# EasyEDA Pro project small_tv.eprj

# Schematic Schematic1
Create Date: 2023-07-25; Page Name: P1; Project Name: small_tv; Schematic Name: Schematic1; Update Date: 2023-07-28; Company: 嘉立创EDA; Page Size: A4; Version: V1.0
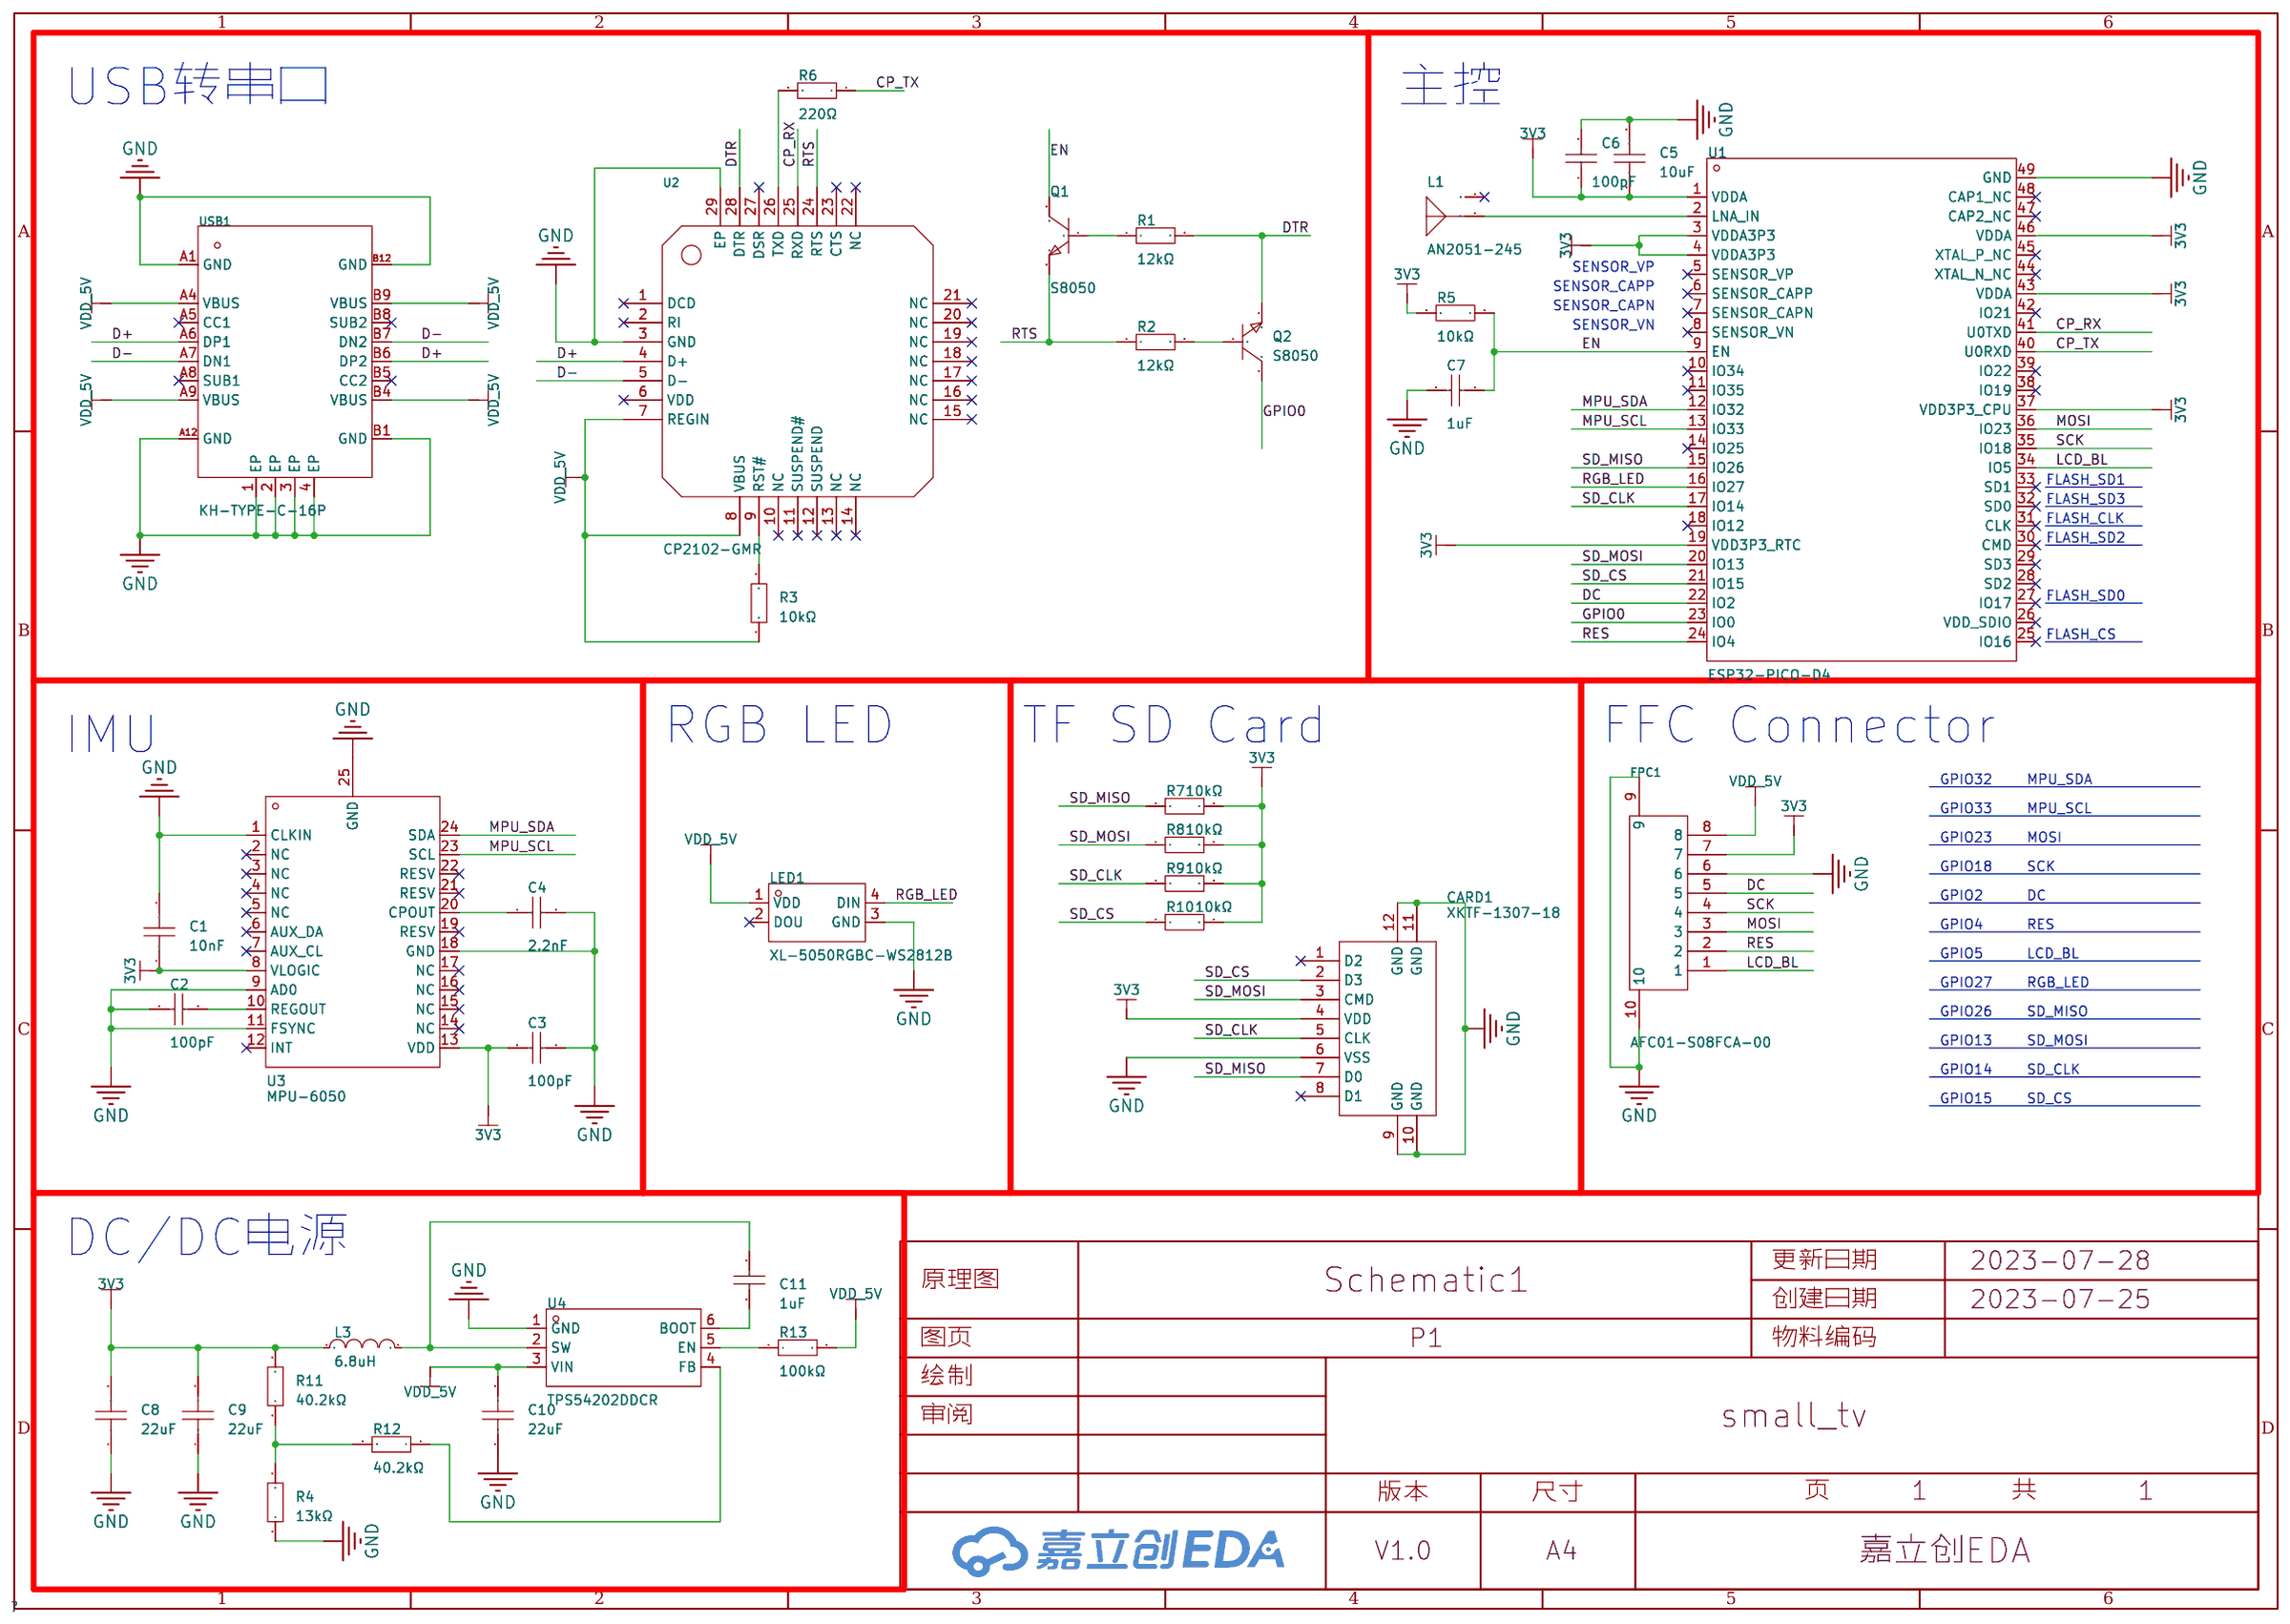
[diagram p0: schematic sheet]

## Parts
C1  10nF  [C0402]
C2  100pF  [C0402]
C3  100pF  [C0402]
C4  2.2nF  [C0402]
C5  10uF  [C0402]
C6  100pF  [C0402]
C7  1uF  [C0402]
C8  22uF  [C0402]
C9  22uF  [C0402]
C10  22uF  [C0402]
C11  1uF  [C0402]
CARD1  XKTF-1307-18  [TF-SMD_XKTF-1307-18]
FPC1  AFC01-S08FCA-00  [FPC-SMD_P0.50-8P_FGS-XJ-H2.0]
L1  AN2051-245  [ANT2051]
L3  6.8uH  [IND-SMD_L4.4-W4.2]
LED1  XL-5050RGBC-WS2812B  [LED-SMD_4P-L5.0-W5.0-BL_XL-5050RGBC]
Q1  S8050  [SOT-23-3_L2.9-W1.6-P1.90-LS2.8-BR]
Q2  S8050  [SOT-23-3_L2.9-W1.6-P1.90-LS2.8-BR]
R1  12kΩ  [R0402]
R2  12kΩ  [R0402]
R3  10kΩ  [R0402]
R4  13kΩ  [C0402]
R5  10kΩ  [R0402]
R6  220Ω  [R0402]
R7  10kΩ  [R0402]
R8  10kΩ  [R0402]
R9  10kΩ  [R0402]
R10  10kΩ  [R0402]
R11  40.2kΩ  [C0402]
R12  40.2kΩ  [C0402]
R13  100kΩ  [C0402]
U1  ESP32-PICO-D4  [LGA-48_L7.0-W7.0-P0.50-BL-EP5.4]
U2  CP2102-GMR  [WQFN-28_L5.0-W5.0-P0.50-BL-EP3.2]
U3  MPU-6050  [QFN-24_L4.0-W4.0-P0.50-BL-EP2.7]
U4  TPS54202DDCR  [SOT-23-6_L2.9-W1.6-P0.95-LS2.8-BL]
USB1  KH-TYPE-C-16P  [USB-C-SMD_KH-TYPE-C-16P]

## Library data of the parts
C1 C5 = CL10A106KP8NNNC: 容值:10uF;精度:±10%;额定电压:10V;材质(温度系数):X5R;; LCSC Part Name: 10uF ±10% 10V; Supplier Part: C19702; Manufacturer: SAMSUNG(三星); Supplier Footprint: 0603; JLCPCB Part Class: 基础库; Datasheet: https://atta.szlcsc.com/upload/public/pdf/source/20160103/1457707703378.pdf; Supplier: LCSC; Tolerance: ±10%; Voltage Rated: 10V; Temperature Coefficient: X5R
C2 C3 C6 = CL10C101JB8NNNC: 容值:100pF;精度:±5%;额定电压:50V;材质(温度系数):C0G;; LCSC Part Name: 100pF ±5% 50V; Supplier Part: C14858; Manufacturer: SAMSUNG(三星); Supplier Footprint: 0603; JLCPCB Part Class: 基础库; Datasheet: https://atta.szlcsc.com/upload/public/pdf/source/20160103/1457707672333.pdf; Supplier: LCSC; Tolerance: ±5%; Voltage Rated: 50V; Temperature Coefficient: C0G
C4 = CC0603JRNPO9BN222: 容值:2.2nF;精度:±5%;额定电压:50V;材质(温度系数):NP0;; LCSC Part Name: 2.2nF ±5% 50V; Supplier Part: C107043; Manufacturer: YAGEO(国巨); Supplier Footprint: 0603; JLCPCB Part Class: 扩展库; Datasheet: https://atta.szlcsc.com/upload/public/pdf/source/20170420/1492670691515.pdf; Supplier: LCSC; Tolerance: ±5%; Voltage Rated: 50V; Temperature Coefficient: NP0
C7 C11 = CL10A105KB8NNNC: 容值:1uF;精度:±10%;额定电压:50V;材质(温度系数):X5R;; LCSC Part Name: 1uF ±10% 50V; Supplier Part: C15849; Manufacturer: SAMSUNG(三星); Supplier Footprint: 0603; JLCPCB Part Class: 基础库; Datasheet: https://atta.szlcsc.com/upload/public/pdf/source/20160103/1457707679084.pdf; Supplier: LCSC; Tolerance: ±10%; Voltage Rated: 50V; Temperature Coefficient: X5R
C8-C10 = CL10A226MP8NUNE: 容值:22uF;精度:±20%;额定电压:10V;材质(温度系数):X5R;; LCSC Part Name: 22uF ±20% 10V; Supplier Part: C86295; Manufacturer: SAMSUNG(三星); Supplier Footprint: 0603; JLCPCB Part Class: 扩展库; Datasheet: https://atta.szlcsc.com/upload/public/pdf/source/20170325/1490427882169.pdf; Supplier: LCSC; Tolerance: ±20%; Voltage Rated: 10V; Temperature Coefficient: X5R
CARD1 = XKTF-1307-18: 卡连接方式:翻盖式;卡类型:MicroSD卡(TF卡);连接器类型:卡座;本体最大高度:1.8mm;触头材质:铜合金;触头镀层:金;工作温度范围:-25℃~+80℃;焊接温度(最大值):260℃;; LCSC Part Name: 翻盖式 MicroSD卡(TF卡) 卡座; Supplier Part: C883270; Manufacturer: XKB Connectivity(中国星坤); Supplier Footprint: SMD; JLCPCB Part Class: 扩展库; Datasheet: https://atta.szlcsc.com/upload/public/pdf/source/20201016/C883270_E734F097901BAAAB6B007AA2692E6303.pdf; Supplier: LCSC; Card Connection Mode: 翻盖式; Card Type: MicroSD卡(TF卡); Connector Type: 卡座; Maximum Body Height: 1.8mm; Contact Material: 铜合金; Contact Plating: 金; Operating Temperature Range: -25℃~+80℃; Welding Temperature (Max): 260℃
FPC1 = AFC01-S08FCA-00: 间距:0.5mm;触点数量:8P;锁定特性:翻盖式;安装类型:卧贴;触点类型:下接;; LCSC Part Name: 0.5mm P数:8P 翻盖式 下接; Supplier Part: C262657; Manufacturer: JS(钜硕电子); Supplier Footprint: SMD,P=0.5mm; JLCPCB Part Class: 扩展库; Datasheet: https://atta.szlcsc.com/upload/public/pdf/source/20190816/C413942_2A72D1AC756EAE17EEDF756A339D4500.pdf; Supplier: LCSC; Pitch: 0.5mm; Number of Contacts: 8P; Locking Feature: 翻盖式; Mounting Type: 卧贴; Contact Type: 下接; Height Above Board: 2mm; FFC, FCB Thickness: 0.3mm
L1 = AN2051-245: 小体积，高增益，WIFI，蓝牙，zigBee 2.4G天线; Supplier Part: C99727; Manufacturer: rainsun(霖昱微); Supplier Footprint: 2x5.1mm; JLCPCB Part Class: 扩展库; Datasheet: https://atta.szlcsc.com/upload/public/pdf/source/20170329/1490752053541.pdf; Supplier: LCSC
L3 = FXL0420-6R8-M: 电感值:6.8uH;精度:±20%;额定电流:2.4A;饱和电流(Isat):2.5A;; LCSC Part Name: 6.8uH ±20% 2.5A; Supplier Part: C177241; Manufacturer: cjiang(长江微电); Supplier Footprint: SMD,4.2x4.4mm; JLCPCB Part Class: 扩展库; Datasheet: https://atta.szlcsc.com/upload/public/pdf/source/20190322/C177241_926E0DC8333CBC0DC90F3B0802D0087D.pdf; Supplier: LCSC; Tolerance: ±20%; Rated Current: 2.4A; Saturation Current (Isat): 2.5A; DC Resistance (DCR): 160mΩ
LED1 = XL-5050RGBC-WS2812B: 发光颜色:RGB三色;二极管配置:-;主波长:-;色温:-;功率:-;安装方式:正贴;; LCSC Part Name: RGB三色 正贴 幻彩; Supplier Part: C2843785; Manufacturer: XINGLIGHT(成兴光); Supplier Footprint: SMD5050; JLCPCB Part Class: 扩展库; Datasheet: https://atta.szlcsc.com/upload/public/pdf/source/20230111/86AAD2096485A2E5BCAB883FF8CBE6FD.pdf; Supplier: LCSC; Emitted Color: RGB三色; Lens Color: 无色透明; Peak Wavelength: 625nm；470nm；530nm; Viewing Angle: 120°; Mounting Sytle: 正贴; Operating Temperature: -30℃~+70℃
Q1 Q2 = S8050_C105433: 晶体管类型:NPN;集射极击穿电压(Vceo):25V;集电极电流(Ic):500mA;功率(Pd):300mW;直流电流增益(hFE@Ic,Vce):120@50mA,1V;; LCSC Part Name: NPN 25V 500mA L档 120-200; Supplier Part: C105433; Manufacturer: CJ(江苏长电/长晶); Supplier Footprint: SOT-23; JLCPCB Part Class: 扩展库; Datasheet: https://atta.szlcsc.com/upload/public/pdf/source/20170415/1492237762328.pdf; Supplier: LCSC; Transistor Type: NPN; Collector-Emitter Breakdown Voltage (Vceo): 25V; Collector Current (Ic): 500mA; Power Dissipation (Pd): 300mW; Collector Cut-Off Current (Icbo): 100nA; Collector-Emitter Saturation Voltage (VCE(sat)@Ic,Ib): 600mV@500mA,50mA; DC Current Gain (hFE@Ic,Vce): 120@50mA,1V; Transition Frequency (fT): 150MHz; Operating Temperature: +150℃@(Tj)
R1 R2 = 0603WAF1202T5E: 电阻类型:厚膜电阻;阻值:12kΩ;精度:±1%;功率:100mW;; LCSC Part Name: 12kΩ ±1% 100mW; Supplier Part: C22790; Manufacturer: UNI-ROYAL(厚声); Supplier Footprint: 0603; JLCPCB Part Class: 基础库; Datasheet: https://atta.szlcsc.com/upload/public/pdf/source/20200306/C422600_1E6D84923E4A46A82E41ADD87F860B5C.pdf; Supplier: LCSC; Type: 厚膜电阻; Tolerance: ±1%; Power(Watts): 100mW; Temperature Coefficient: ±100ppm/℃; Overload Voltage (Max): 75V; Operating Temperature Range: -55℃~+155℃
R3 R5 R7-R10 = 0603WAF1002T5E: 电阻类型:厚膜电阻;阻值:10kΩ;精度:±1%;功率:100mW;; LCSC Part Name: 厚膜电阻 10kΩ ±1% 100mW; Supplier Part: C25804; Manufacturer: UNI-ROYAL(厚声); Supplier Footprint: 0603; JLCPCB Part Class: 基础库; Datasheet: https://atta.szlcsc.com/upload/public/pdf/source/20200306/C422600_1E6D84923E4A46A82E41ADD87F860B5C.pdf; Supplier: LCSC; Type: 厚膜电阻; Tolerance: ±1%; Power(Watts): 100mW; Temperature Coefficient: ±100ppm/℃; Overload Voltage (Max): 75V; Operating Temperature Range: -55℃~+155℃
R4 = 0603WAF1302T5E: 电阻类型:厚膜电阻;阻值:13kΩ;精度:±1%;功率:100mW;; LCSC Part Name: 13kΩ ±1% 100mW; Supplier Part: C22797; Manufacturer: UNI-ROYAL(厚声); Supplier Footprint: 0603; JLCPCB Part Class: 基础库; Datasheet: https://atta.szlcsc.com/upload/public/pdf/source/20200306/C422600_1E6D84923E4A46A82E41ADD87F860B5C.pdf; Supplier: LCSC; Type: 厚膜电阻; Tolerance: ±1%; Power(Watts): 100mW; Temperature Coefficient: ±100ppm/℃; Overload Voltage (Max): 75V; Operating Temperature Range: -55℃~+155℃
R6 = 0603WAF2200T5E: 电阻类型:厚膜电阻;阻值:220Ω;精度:±1%;功率:100mW;; LCSC Part Name: 220Ω ±1% 100mW; Supplier Part: C22962; Manufacturer: UNI-ROYAL(厚声); Supplier Footprint: 0603; JLCPCB Part Class: 基础库; Datasheet: https://atta.szlcsc.com/upload/public/pdf/source/20200306/C422600_1E6D84923E4A46A82E41ADD87F860B5C.pdf; Supplier: LCSC; Type: 厚膜电阻; Tolerance: ±1%; Power(Watts): 100mW; Temperature Coefficient: ±100ppm/℃; Overload Voltage (Max): 75V; Operating Temperature Range: -55℃~+155℃
R11 R12 = 0603WAF4022T5E: 电阻类型:厚膜电阻;阻值:40.2kΩ;精度:±1%;功率:100mW;; LCSC Part Name: 40.2kΩ ±1% 100mW; Supplier Part: C12447; Manufacturer: UNI-ROYAL(厚声); Supplier Footprint: 0603; JLCPCB Part Class: 基础库; Datasheet: https://atta.szlcsc.com/upload/public/pdf/source/20200306/C422600_1E6D84923E4A46A82E41ADD87F860B5C.pdf; Supplier: LCSC; Type: 厚膜电阻; Tolerance: ±1%; Power(Watts): 100mW; Temperature Coefficient: ±100ppm/℃; Overload Voltage (Max): 75V; Operating Temperature Range: -55℃~+155℃
R13 = 0603WAF1003T5E: 电阻类型:厚膜电阻;阻值:100kΩ;精度:±1%;功率:100mW;; LCSC Part Name: 100kΩ ±1% 100mW; Supplier Part: C25803; Manufacturer: UNI-ROYAL(厚声); Supplier Footprint: 0603; JLCPCB Part Class: 基础库; Datasheet: https://atta.szlcsc.com/upload/public/pdf/source/20200306/C422600_1E6D84923E4A46A82E41ADD87F860B5C.pdf; Supplier: LCSC; Type: 厚膜电阻; Tolerance: ±1%; Power(Watts): 100mW; Temperature Coefficient: ±100ppm/℃; Overload Voltage (Max): 75V; Operating Temperature Range: -55℃~+155℃
U1 = ESP32-PICO-D4: 功能:WiFi, 蓝牙;工作电压:2.7V~3.6V;通信频率:2.4GHz~2.5GHz;接口类型:ADC, SDIO, SPI, PWM, UART, I2C, I2S, GPIO;模式:-;工作温度:-40℃~+85℃;; Supplier Part: C193707; Manufacturer: ESPRESSIF(乐鑫); Supplier Footprint: QFN-48(7x7); JLCPCB Part Class: 扩展库; Datasheet: https://atta.szlcsc.com/upload/public/pdf/source/20180531/C193707_20E6BADDB6EC95F0C0D505BA515D2866.pdf; Supplier: LCSC; Function: WiFi, 蓝牙; Operating Voltage: 2.7V~3.6V; Frequency Of Communication: 2.4GHz~2.5GHz; Serial Interfaces: ADC, SDIO, SPI, PWM, UART, I2C, I2S, GPIO; Operating Temperature: -40℃~+85℃
U2 = CP2102-GMR: 应用功能:收发器;接口协议:USB;数据速率:1Mbps;; Supplier Part: C6568; Manufacturer: SILICON LABS(芯科); Supplier Footprint: WQFN-28-EP(5x5); JLCPCB Part Class: 基础库; Datasheet: https://atta.szlcsc.com/upload/public/pdf/source/20170103/1483439882795.pdf; Supplier: LCSC; Applications Function: 收发器; Protocol: USB; Data Rate: 1Mbps; Supply Voltage: 3V~3.6V
U3 = MPU-6050: 三轴加速度计和三轴陀螺仪，工作电压：2.375V~3.46V; Supplier Part: C24112; Manufacturer: TDK InvenSense(应美盛); Supplier Footprint: QFN-24(4x4); JLCPCB Part Class: 基础库; Datasheet: https://atta.szlcsc.com/upload/public/pdf/source/20140425/1457707046159.pdf; Supplier: LCSC
U4 = TPS54202DDCR: 可输出电流:2A;开关工作频率:500kHz;输出类型:Adjustable;输出电压的路数:1;功能类型:Step-Down;输出配置:Positive;; Supplier Part: C191884; Manufacturer: TI(德州仪器); Supplier Footprint: SOT-23-6; JLCPCB Part Class: 扩展库; Datasheet: https://atta.szlcsc.com/upload/public/pdf/source/20181012/C191884_C6DBFD980275651BD8C8F427C2E48058.pdf; Supplier: LCSC
USB1 = KH-TYPE-C-16P: Type-C母座 16PIN 立式四角贴板无压片; LCSC Part Name: Type-C母座; Supplier Part: C709357; Manufacturer: kinghelm(金航标); JLCPCB Part Class: 扩展库; Supplier: LCSC

## Nets
3V3: C1.1 C3.1 C5.1 C6.1 C8.2 C9.2 CARD1.4(VDD) FPC1.7 L3.1 R5.2 R7.2 R8.2 R9.2 R10.2 R11.2 U1.1(VDDA) U1.3(VDDA3P3) U1.4(VDDA3P3) U1.19(VDD3P3_RTC) U1.37(VDD3P3_CPU) U1.43(VDDA) U1.46(VDDA) U3.8(VLOGIC) U3.13(VDD)
GND: C1.2 C2.1 C3.2 C4.2 C5.2 C6.2 C7.2 C8.1 C9.1 C10.1 CARD1.6(VSS) CARD1.9(GND) CARD1.10(GND) CARD1.11(GND) CARD1.12(GND) FPC1.6 FPC1.9 FPC1.10 LED1.3(GND) R4.1 U1.49(GND) U2.3(GND) U2.29(EP) U3.1(CLKIN) U3.9(AD0) U3.11(FSYNC) U3.18(GND) U3.25(GND) U4.1(GND) USB1.1(EP) USB1.2(EP) USB1.3(EP) USB1.4(EP) USB1.A1(GND) USB1.A12(GND) USB1.B1(GND) USB1.B12(GND)
VDD_5V: C10.2 FPC1.8 LED1.1(VDD) R3.1 R13.2 U2.7(REGIN) U2.8(VBUS) U4.3(VIN) USB1.A4(VBUS) USB1.A9(VBUS) USB1.B4(VBUS) USB1.B9(VBUS)
CP_RX: U1.41(U0TXD) U2.25(RXD)
CP_TX: R6.1 U1.40(U0RXD)
D+: U2.4(D+) USB1.A6(DP1) USB1.B6(DP2)
D-: U2.5(D-) USB1.A7(DN1) USB1.B7(DN2)
DC: FPC1.5 U1.22(IO2)
DTR: Q2.2 R1.2 U2.28(DTR)
EN: C7.1 Q1.3 R5.1 U1.9(EN)
GPIO0: Q2.3 U1.23(IO0)
LCD_BL: FPC1.1 U1.34(IO5)
MOSI: FPC1.3 U1.36(IO23)
MPU_SCL: U1.13(IO33) U3.23(SCL)
MPU_SDA: U1.12(IO32) U3.24(SDA)
RES: FPC1.2 U1.24(IO4)
RGB_LED: LED1.4(DIN) U1.16(IO27)
RTS: Q1.2 R2.1 U2.24(RTS)
SCK: FPC1.4 U1.35(IO18)
SD_CLK: CARD1.5(CLK) R9.1 U1.17(IO14)
SD_CS: CARD1.2(D3) R10.1 U1.21(IO15)
SD_MISO: CARD1.7(D0) R7.1 U1.15(IO26)
SD_MOSI: CARD1.3(CMD) R8.1 U1.20(IO13)
$1N4060: R3.2 U2.9(RST#)
$1N4160: R6.2 U2.26(TXD)
$1N4317: Q1.1 R1.1
$1N4322: Q2.1 R2.2
$1N4474: C2.2 U3.10(REGOUT)
$1N4542: C4.1 U3.20(CPOUT)
$1N4984: L1.1(ANT) U1.2(LNA_IN)
$1N7801: C11.2 L3.2 U4.2(SW)
$1N7802: C11.1 U4.6(BOOT)
$1N7803: R4.2 R11.1 R12.2
$1N7813: R13.1 U4.5(EN)
$1N7855: R12.1 U4.4(FB)

Not connected (* = marked no-connect by the designer): CARD1 1(D2)* 8(D1)*; L1 2*; LED1 2(DOU)*; U1 5(SENSOR_VP)* 6(SENSOR_CAPP)* 7(SENSOR_CAPN)* 8(SENSOR_VN)* 10(IO34)* 11(IO35)* 14(IO25)* 18(IO12)* 25(IO16)* 26(VDD_SDIO)* 27(IO17)* 28(SD2)* 29(SD3)* 30(CMD)* 31(CLK)* 32(SD0)* 33(SD1)* 38(IO19)* 39(IO22)* 42(IO21)* 44(XTAL_N_NC)* 45(XTAL_P_NC)* 47(CAP2_NC)* 48(CAP1_NC)*; U2 1(DCD)* 2(RI)* 6(VDD)* 10(NC)* 11(SUSPEND#)* 12(SUSPEND)* 13(NC)* 14(NC)* 15(NC)* 16(NC)* 17(NC)* 18(NC)* 19(NC)* 20(NC)* 21(NC)* 22(NC)* 23(CTS)* 27(DSR)*; U3 2(NC)* 3(NC)* 4(NC)* 5(NC)* 6(AUX_DA)* 7(AUX_CL)* 12(INT)* 14(NC)* 15(NC)* 16(NC)* 17(NC)* 19(RESV)* 21(RESV)* 22(RESV)*; USB1 A5(CC1)* A8(SUB1)* B5(CC2)* B8(SUB2)*

## Notes on the sheet
- USB转串口
- 主控
- SENSOR_VP
- SENSOR_CAPP
- SENSOR_CAPN
- SENSOR_VN
- FLASH_SD1
- FLASH_CLK
- FLASH_SD3
- FLASH_SD2
- FLASH_SD0
- FLASH_CS
- RGB LED
- TF SD Card
- FFC Connector
- IMU
- GPIO32
- MPU_SDA
- GPIO33
- MPU_SCL
- GPIO23
- MOSI
- GPIO18
- SCK
- GPIO2
- DC
- GPIO4
- RES
- GPIO5
- LCD_BL
- GPIO27
- RGB_LED
- GPIO26
- SD_MISO
- GPIO13
- SD_MOSI
- GPIO14
- SD_CLK
- GPIO15
- SD_CS
- DC/DC电源

# Board PCB1
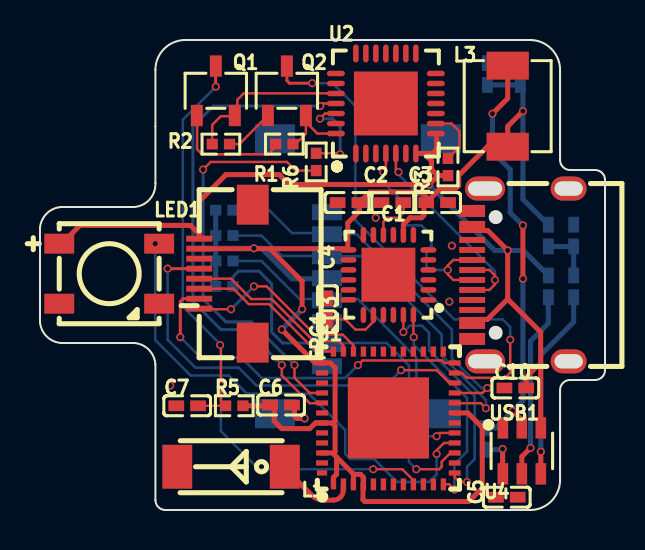
[diagram p1: board, top side]
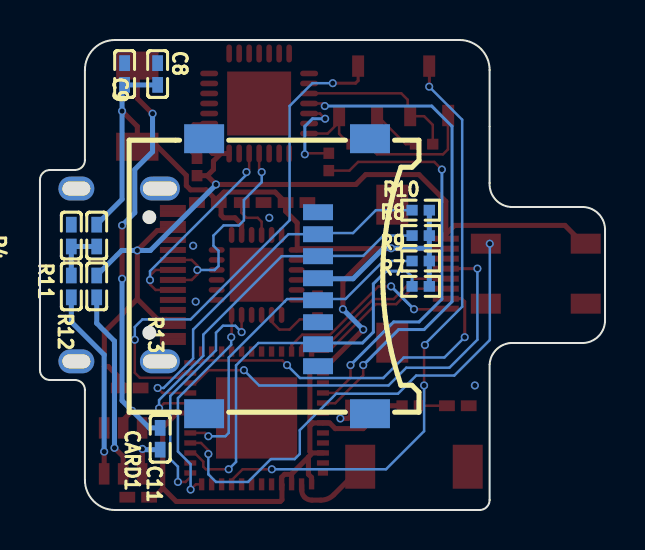
[diagram p2: board, bottom side, seen from below]

Outline 28.28 x 23.5 mm; copper layers: Top Layer, Bottom Layer. Coordinates in mm from the lower left corner of the outline.
Outline path: 0,13.95 0,9.43 arc(0.38,8.64) 1.2,8.35 4.57,8.35 arc(5.4,8.06) 5.78,7.28 5.78,0.5 arc(5.92,0.15) 6.28,0 24.53,0 arc(25.59,0.44) 26.03,1.5 26.03,6 arc(26.17,6.35) 26.53,6.5 27.78,6.5 arc(28.13,6.65) 28.28,7 28.28,16.5 arc(28.13,16.85) 27.78,17 26.53,17 arc(26.17,17.15) 26.03,17.5 26.03,22 arc(25.59,23.06) 24.53,23.5 7.28,23.5 arc(6.21,23.06) 5.78,22 5.78,16.35 arc(5.49,15.53) 4.7,15.15 1.07,15.15 arc(0.29,14.77) 0,13.95
Stack: Top Layer 0.035mm / Dielectric1 1.51mm FR4 er 4.5 / Bottom Layer 0.035mm

## Design rules (mm)
template: 自定义配置
spacing copperThickness1oz (default): track to track 0.127, other pairs 0.127 to 0.127
track width copperThickness1oz (default): min 0.127, default 0.254, max 2.54
track width copperThickness2oz: min 0.203, default 0.254, max 2.54
differential pair differentialPair (default): width min 0.127, default 0.254, max 2.54; gap min 0.152, default 0.152
via viaSize (default): diameter min 0.406, default 0.61, max 10; hole min 0.254, default 0.305, max 6.299

## Placement (name value [footprint] x y rotation side)
C1  10nF  [C0402]  15.44 15.37 180 top
C2  100pF  [C0402]  17.63 15.37 0 top
C3  100pF  [C0402]  19.87 15.37 0 top
C4  2.2nF  [C0402]  14.39 10.04 90 top
C5  10uF  [C0402]  23.36 0.64 0 top
C6  100pF  [C0402]  12.06 5.25 0 top
C7  1uF  [C0402]  7.37 5.21 180 top
C8  22uF  [C0402]  22.39 21.8 270 bottom
C9  22uF  [C0402]  24.04 21.8 270 bottom
C10  22uF  [C0402]  23.78 6.1 0 top
C11  1uF  [C0402]  22.26 3.56 90 bottom
CARD1  XKTF-1307-18  [TF-SMD_XKTF-1307-18]  15.91 11.69 90 bottom
FPC1  AFC01-S08FCA-00  [fpc-smd_p0.50-8p_fgs-xj-h2.0]  9.31 11.82 270 top
L1  AN2051-245  [ANT2051]  9.56 2.16 180 top
L3  6.8uH  [IND-SMD_L4.4-W4.2]  23.4 20.19 270 top
LED1  XL-5050RGBC-WS2812B  [LED-SMD_4P-L5.0-W5.0-BL_XL-5050RGBC]  3.46 11.82 270 top
Q1  S8050  [SOT-23-3_L2.9-W1.6-P1.90-LS2.8-BR]  8.8 20.96 270 top
Q2  S8050  [SOT-23-3_L2.9-W1.6-P1.90-LS2.8-BR]  12.35 20.96 270 top
R1  12kΩ  [R0402]  12.23 18.29 0 top
R2  12kΩ  [R0402]  9.05 18.29 0 top
R3  10kΩ  [R0402]  20.42 17.15 90 top
R4  13kΩ  [C0402]  26.71 13.72 270 bottom
R5  10kΩ  [R0402]  9.72 5.21 0 top
R6  220Ω  [R0402]  13.82 17.4 90 top
R7  10kΩ  [R0402]  9.23 11.18 180 bottom
R8  10kΩ  [R0402]  9.23 13.72 180 bottom
R9  10kΩ  [R0402]  9.23 12.45 180 bottom
R10  10kΩ  [R0402]  9.23 14.99 180 bottom
R11  40.2kΩ  [C0402]  25.44 13.72 90 bottom
R12  40.2kΩ  [C0402]  26.71 11.18 90 bottom
R13  100kΩ  [C0402]  25.44 11.18 90 bottom
U1  ESP32-PICO-D4  [LGA-48_L7.0-W7.0-P0.50-BL-EP5.4]  17.43 4.6 0 top
U2  CP2102-GMR  [WQFN-28_L5.0-W5.0-P0.50-BL-EP3.2]  17.31 20.33 0 top
U3  MPU-6050  [QFN-24_L4.0-W4.0-P0.50-BL-EP2.7]  17.43 11.75 90 top
U4  TPS54202DDCR  [sot-23-6_l2.9-w1.6-p0.95-ls2.8-bl]  24.11 2.96 180 top
USB1  KH-TYPE-C-16P  [USB-C-SMD_KH-TYPE-C-16P]  24.04 11.75 90 top

## Footprints (pads in the part's own frame, mm; a bottom-side part is the same pattern mirrored in y, then rotated)
ANT2051
  rect 1.5x2.2 smd: 1(-2.69,0) 2(2.69,0)
C0402
  rect 0.79x0.54 smd: 1(-0.545,0) 2(0.545,0)
fpc-smd_p0.50-8p_fgs-xj-h2.0
  rect 0.3x1.3 smd: 1(1.75,-1.34) 2(1.252,-1.339) 3(0.75,-1.34) 4(0.25,-1.34) 5(-0.25,-1.34) 6(-0.75,-1.34) 7(-1.25,-1.34) 8(-1.75,-1.34)
  rect 2x1.6 smd: 9(-3.45,1.34) 10(3.45,1.34)
IND-SMD_L4.4-W4.2
  rect 1.4x2.12 smd: 1(2.028,0) 2(-2.028,0)
LED-SMD_4P-L5.0-W5.0-BL_XL-5050RGBC
  rect 1x1.5 smd: 1(-1.5,-2.5) 2(1.5,-2.5) 3(1.5,2.5) 4(-1.5,2.5)
LGA-48_L7.0-W7.0-P0.50-BL-EP5.4
  rect 0.27x0.508 smd: 1(-2.75,-3.32) 25(2.75,3.32) 26(2.25,3.32) 27(1.75,3.32) 28(1.25,3.32) 29(0.75,3.32) 30(0.25,3.32) 31(-0.25,3.32) 32(-0.75,3.32) 33(-1.25,3.32) 34(-1.75,3.32) 35(-2.25,3.32) 36(-2.75,3.32)
  rect 0.27x0.6 smd: 2(-2.25,-3.32) 3(-1.75,-3.32) 4(-1.25,-3.32) 5(-0.75,-3.32) 6(-0.25,-3.32) 7(0.25,-3.32) 8(0.75,-3.32) 9(1.25,-3.32) 10(1.75,-3.32) 11(2.25,-3.32) 12(2.75,-3.32)
  rect 0.6x0.27 smd: 13(3.32,-2.75) 14(3.32,-2.25) 15(3.32,-1.75) 16(3.32,-1.25) 17(3.32,-0.75) 18(3.32,-0.25) 19(3.32,0.25) 20(3.32,0.75) 21(3.32,1.25) 22(3.32,1.75) 23(3.32,2.25) 24(3.32,2.75) 38(-3.32,2.25) 39(-3.32,1.75) 40(-3.32,1.25) 41(-3.32,0.75) 42(-3.32,0.25) 43(-3.32,-0.25) 44(-3.32,-0.75) 45(-3.32,-1.25) 46(-3.32,-1.75) 47(-3.32,-2.25)
  rect 0.508x0.27 smd: 37(-3.32,2.75) 48(-3.32,-2.75)
  rect 4.064x4.064 smd: 49(0,0)
QFN-24_L4.0-W4.0-P0.50-BL-EP2.7
  oval 0.28x0.8 smd: 1(-1.25,-2) 2(-0.75,-2) 3(-0.25,-2) 4(0.25,-2) 5(0.75,-2) 6(1.25,-2) 13(1.25,2) 14(0.75,2) 15(0.25,2) 16(-0.25,2) 17(-0.75,2) 18(-1.242,2)
  oval 0.8x0.28 smd: 7(2,-1.25) 8(2,-0.75) 9(2,-0.25) 10(2,0.25) 11(2,0.75) 12(2,1.25) 19(-2,1.25) 20(-2,0.75) 21(-2,0.25) 22(-2,-0.25) 23(-2,-0.75) 24(-2,-1.25)
  rect 2.7x2.7 smd: 25(0.013,0)
R0402
  rect 0.566x0.54 smd: 1(-0.433,0) 2(0.433,0)
SOT-23-3_L2.9-W1.6-P1.90-LS2.8-BR
  rect 1.07x0.6 smd: 1(1.235,-0.95) 2(1.235,0.95) 3(-1.235,0)
sot-23-6_l2.9-w1.6-p0.95-ls2.8-bl
  rect 0.532x1.072 smd: 1(0.95,-1.149) 2(0,-1.149) 3(-0.95,-1.149) 4(-0.95,1.149) 5(0,1.149) 6(0.95,1.149)
TF-SMD_XKTF-1307-18
  rect 0.8x1.5 smd: 1(3.2,-1.55) 2(2.1,-1.55) 3(1,-1.55) 4(-0.1,-1.55) 5(-1.2,-1.55) 6(-2.3,-1.55) 7(-3.4,-1.55) 8(-4.5,-1.55)
  rect 1.45x2 smd: 9(-6.875,4.15) 10(-6.875,-4.15) 11(6.875,-4.15) 12(6.875,4.15)
USB-C-SMD_KH-TYPE-C-16P
  oval 1.2x2 hole 0.7x1.7: 1(-4.32,1.765) 2(4.32,1.765)
  oval 1.2x1.8 hole 0.7x1.4: 3(-4.32,-2.415) 4(4.32,-2.415)
  rect 0.3x1.3 smd: A1(-3.35,2.415) A4(-2.55,2.415) A5(-1.25,2.415) A6(-0.25,2.415) A7(0.25,2.415) A8(1.25,2.415) A9(2.55,2.415) A12(3.35,2.415) B1(3.05,2.415) B4(2.25,2.415) B5(1.75,2.415) B6(0.75,2.415) B7(-0.75,2.415) B8(-1.75,2.415) B9(-2.25,2.415) B12(-3.05,2.415)
WQFN-28_L5.0-W5.0-P0.50-BL-EP3.2
  oval 0.28x0.9 smd: 1(-1.502,-2.5) 2(-1.001,-2.5) 3(-0.5,-2.5) 4(0,-2.5) 5(0.5,-2.5) 6(1,-2.5) 7(1.501,-2.5) 15(1.501,2.5) 16(1,2.5) 17(0.5,2.5) 18(0,2.5) 19(-0.5,2.5) 20(-1.001,2.5) 21(-1.502,2.5)
  oval 0.9x0.28 smd: 8(2.5,-1.502) 9(2.5,-1.001) 10(2.5,-0.5) 11(2.5,0) 12(2.5,0.5) 13(2.5,1) 14(2.5,1.501) 22(-2.5,1.501) 23(-2.5,1) 24(-2.5,0.5) 25(-2.5,0) 26(-2.5,-0.5) 27(-2.5,-1.001) 28(-2.5,-1.502)
  rect 3.2x3.2 smd: 29(0,0)

## Nets
As in the schematic.

Pads without a net: CARD1 1 8; L1 2; LED1 2; U1 5 6 7 8 10 11 14 18 25 26 27 28 29 30 31 32 33 38 39 42 44 45 47 48; U2 1 2 6 10 11 12 13 14 15 16 17 18 19 20 21 22 23 27; U3 2 3 4 5 6 7 12 14 15 16 17 19 21 22; USB1 A5 A8 B5 B8

## Via types
v1: diameter 0.406, hole 0.254, Top Layer to Bottom Layer, 50 vias

## Routing (per net, layer and track width the routed paths; a pad name or vN(x,y) marks a point on that pad's centre or on a via; arc(x,y) is an arc through that point)
3V3: length 79.2
  Top Layer w0.254: 15.4,13.03 15.4,14.36 15.98,14.94 C1.1 16.51,15.9 19.07,15.9 19.33,15.64 C3.1 ; 15.4,13.03 15.37,13.07 11.5,13.07 ; 15.4,13.03 U3.13 ; C3.1 19.96,16.01 20.74,16.01 20.95,16.22 20.95,16.73 22.39,18.16 L3.1 23.4,19.18 v1(24.17,19.94) ; C3.1 19.21,15.26 19.21,14.74 19.09,14.61 18.52,14.61 18.18,14.28 U3.8 ; v1(13.12,10.04) 13.12,11.44 11.5,13.05 11.5,13.07 ; 10.15,5.21 11.48,5.21 C6.1 11.72,5.05 11.72,4.45 12.1,4.07 13.5,4.07 13.78,4.35 U1.43 14.61,4.35 14.64,4.32 ; 14.64,4.32 14.77,4.2 14.77,2.93 14.69,2.85 U1.46 ; 14.64,4.32 14.77,4.45 14.77,7.12 14.53,7.35 U1.37 13.77,7.35 v1(12.1,9.02) ; 15.68,1.8 15.7,1.78 16.04,1.78 16.18,1.64 U1.4 16.16,1.26 16.16,0.51 16.25,0.43 21.46,0.43 22.13,1.1 ; 15.68,1.8 U1.3 ; 15.68,1.8 14.84,2.65 ; FPC1.7 10.68,13.07 ; 10.68,13.07 11.5,13.07 ; 10.68,13.07 v1(10.7,13.09) ; 22.13,1.1 22.13,4.13 21.41,4.85 U1.19 ; 22.13,1.1 22.13,1.07 22.69,0.51 ; 14.84,2.65 14.71,2.77 ; 14.84,2.65 14.84,1.78 14.68,1.63 U1.1
  Bottom Layer w0.127: 8.83,13.09 8.79,13.12
  Bottom Layer w0.254: 8.79,11.18 8.79,14.99 ; v1(13.12,10.04) v1(12.1,9.02) ; 22.39,21.25 24.04,21.25 24.17,21.13 v1(24.17,19.94) 24.17,15.54 R11.2 ; CARD1.4 14.33,11.56 12.61,11.56 11.08,13.09 v1(10.7,13.09) 8.83,13.09
GND: length 1.2
  Top Layer w0.254: C6.2 12.74,5.12 12.74,4.7 12.86,4.58 v1(13.24,4.58)
  vias: v1(6.51,6.23) v1(16.8,14.61) v1(20.48,10.42) v1(20.61,13.21)
VDD_5V: length 49.9
  Top Layer w0.254: U2.8 19.85,18.78 19.85,18.04 19.63,17.83 19.22,17.83 ; 24.94,3.85 25.05,3.97 25.05,7.18 ; 19.22,17.83 19.59,17.45 19.59,17.02 19.9,16.72 19.91,16.72 ; 19.22,17.83 U2.7 ; R3.1 19.91,16.72 ; 19.91,16.72 v1(19.47,16.28) 12.47,16.28 11.97,16.77 9.31,16.77 7.97,15.43 7.97,13.79 ; 7.97,13.79 7.53,14.23 2,14.23 1.09,13.32 ; 7.97,13.79 FPC1.8 ; 25.05,7.18 25.05,8.9 23.4,10.55 ; 25.05,7.18 24.86,7.18 24.33,6.65 C10.2 ; USB1.A9 21.95,13.98 22.41,13.98 v1(23.4,12.98) 23.4,10.55 ; 23.4,10.55 22.39,9.53 21.95,9.53 USB1.A4
  Bottom Layer w0.254: R13.2 24.18,12.98 v1(23.4,12.98) 22.75,12.98 19.47,16.26 v1(19.47,16.28)
CP_RX: length 25.3
  Top Layer w0.127: v1(12.1,7.24) 12.1,6.74 13.5,5.34 14.1,5.34 U1.41 ; v1(14.02,20.2) 14.15,20.33 U2.25
  Bottom Layer w0.152: v1(12.1,7.24) 10.32,9.02 9.05,9.02 7.66,10.42 7.66,19.18 8.67,20.2 v1(14.02,20.2)
CP_TX: length 20.9
  Top Layer w0.127: U1.40 13.49,5.85 12.74,6.61 v1(12.74,7.24) ; 13.95,16.97 12.79,16.97 12.35,17.4 8.54,17.4 v1(8.16,17.02)
  Bottom Layer w0.152: v1(8.16,17.02) 8.16,10.55 9.31,9.4 10.58,9.4 v1(12.74,7.24)
D+: length 11.3
  Top Layer w0.127: U2.4 17.31,17.02 v1(17.18,16.9) ; 21.55,11.5 20.68,11.5 20.4,11.78 v1(20.4,12) 20.4,12.22 20.68,12.5 21.55,12.5
  Bottom Layer w0.127: v1(17.18,16.9) 17.18,16.39 18.07,15.5 18.07,14.48 18.32,14.23 19.09,14.23 19.59,13.72 19.59,13.21 19.34,12.96 19.34,12.2 19.53,12 v1(20.4,12)
D-: length 11.3
  Top Layer w0.127: USB1.A7 22.49,12 22.77,11.72 v1(22.77,11.5) 22.77,11.28 22.49,11 USB1.B7 ; v1(17.94,16.9) 17.94,16.9 17.81,17.02 U2.5
  Bottom Layer w0.127: v1(22.77,11.5) 22.77,11.94 17.94,16.77 v1(17.94,16.9)
DC: length 20.8
  Top Layer w0.127: v1(18.07,6.99) 19.85,6.99 20.49,6.35 U1.22
  Top Layer w0.152: 7.71,12.07 6.39,12.07 v1(6.39,12.07)
  Bottom Layer w0.127: v1(6.39,12.07) 6.39,8.51 7.78,7.12 9.94,7.12 10.83,6.23 17.31,6.23 v1(18.07,6.99)
DTR: length 3.5
  Top Layer w0.127: 14.93,18.82 13.88,18.82 13.3,19.4 13.3,18.81 12.79,18.29
  Top Layer w0.152: 13.3,19.4 Q2.2
EN: length 33.1
  Top Layer w0.127: U1.9 18.68,1.49 18.13,2.04 v1(16.67,2.04) ; 7.91,5.21 9.29,5.21 9.05,5.45 v1(9.05,6.23) 9.05,8.21 v1(9.01,8.25)
  Top Layer w0.152: 8.93,22.2 8.79,22.06 8.79,21.18 v1(8.8,21.17)
  Bottom Layer w0.127: v1(8.8,21.17) 7.15,19.52 7.15,10.17 9.01,8.3 ; v1(16.67,2.04) 10.96,2.04 9.05,3.94 v1(9.05,6.23)
GPIO0: length 25.6
  Top Layer w0.127: v1(23.53,8.51) 23.53,6.86 23.28,6.61 21.36,6.61 21.12,6.85 U1.23
  Top Layer w0.152: Q2.3 12.35,21.47 12.48,21.34 v1(13.62,21.34)
  Bottom Layer w0.127: v1(23.53,8.51) 23.53,9.15 23.15,9.53 20.74,9.53 15.78,14.48 15.78,20.2 14.64,21.34 v1(13.62,21.34)
LCD_BL: length 10
  Top Layer w0.127: 7.71,10.07 7.74,10.04 v1(9.56,10.04) ; v1(10.7,11.18) 11.34,11.18 13.75,8.77 15.15,8.77 15.68,8.23 U1.34
  Bottom Layer w0.152: v1(10.7,11.18) v1(9.56,10.04)
MOSI: length 8.3
  Top Layer w0.127: 7.71,11.07 9.68,11.07 10.45,10.29 11.47,10.29 13.84,7.92 U1.36
MPU_SCL: length 11.9
  Top Layer w0.127: v1(21.37,1.4) 20.99,1.4 20.75,1.64 U1.13 ; v1(18.18,8.9) U3.23
  Bottom Layer w0.127: v1(21.37,1.4) 21.37,2.16 21.75,2.55 21.75,5.7 19.47,7.99 19.47,8.86 19.12,9.21 18.5,9.21 v1(18.18,8.9)
MPU_SDA: length 10.8
  Top Layer w0.127: v1(20.74,1.02) 20.47,1.28 U1.12 ; v1(18.7,8.64) 18.68,8.66 U3.24
  Bottom Layer w0.127: v1(20.74,1.02) 20.74,2.29 21.37,2.93 21.37,5.59 18.7,8.26 v1(18.7,8.64)
RES: length 17.7
  Top Layer w0.127: U1.24 20.25,7.35 20.12,7.48 16.14,7.48 v1(15.91,7.24)
  Top Layer w0.152: v1(7.02,8.64) 7.02,10.42 7.17,10.56 7.84,10.56
  Bottom Layer w0.127: v1(7.02,8.64) 8.04,7.62 10.07,7.62 11.09,6.6 15.27,6.6 v1(15.91,7.24)
RGB_LED: length 25
  Top Layer w0.127: v1(19.85,2.8) 19.85,2.98 20.22,3.35 U1.16
  Bottom Layer w0.127: v1(5.77,13.32) 5.77,8.5 7.54,6.72 9.45,6.72 10.36,5.82 13.45,5.82 15.28,3.99 15.28,2.8 15.53,2.55 16.72,2.55 17.86,1.4 19.47,1.4 19.85,1.78 v1(19.85,2.8)
RTS: length 8.7
  Top Layer w0.127: 9.88,19.73 9.88,20.51 10.2,20.83 15.05,20.83 ; R2.1 8.62,19.26 9.05,19.69 9.84,19.69
  Top Layer w0.152: 8.49,18.29 8.49,18.34 8.62,18.47 ; 9.88,19.73 9.84,19.69
SCK: length 9.2
  Top Layer w0.127: U1.35 15.18,8.22 14.97,8.44 13.7,8.44 11.59,10.55 10.58,10.55 9.56,11.57 7.71,11.57
SD_CLK: length 17
  Top Layer w0.127: U1.17 20.01,3.85 v1(19.85,3.69)
  Bottom Layer w0.127: R9.1 11.08,12.45 12.99,10.55 14.36,10.55 14.36,10.55 15.91,10.55 16.03,10.42 16.03,10.42 18.83,7.62 18.83,3.85 19,3.69 v1(19.85,3.69)
SD_CS: length 18.9
  Top Layer w0.127: v1(22.39,6.1) 22.14,5.85 U1.21
  Bottom Layer w0.127: v1(22.39,6.1) 22.09,6.1 20.61,7.58 20.61,9.02 15.84,13.79 CARD1.2 ; R10.1 11.47,14.99 12.61,13.85 14.32,13.85 14.32,13.85
SD_MISO: length 20.5
  Top Layer w0.127: v1(18.83,2.04) 19.97,2.04 20.1,2.16 20.1,2.42 20.54,2.85 U1.15
  Bottom Layer w0.127: 14.32,8.35 17.34,8.35 18.46,7.23 18.46,2.41 v1(18.83,2.04)
  Bottom Layer w0.152: R7.1 9.66,11.66 9.94,11.94 10.96,11.94 11.59,11.31 11.59,8.9 12.14,8.35 14.32,8.35
SD_MOSI: length 18.8
  Top Layer w0.127: v1(22.31,5.09) 22.07,5.34 20.68,5.34
  Bottom Layer w0.127: v1(22.31,5.09) 22.31,5.5 20.1,7.71 20.1,8.77 16.18,12.69 CARD1.3 14.34,12.71 12.1,12.71 11.08,13.72 R8.1
$1N4060: length 2.6
  Top Layer w0.127: 20.54,17.71 20.99,18.16 20.99,18.93 20.59,19.32 19.93,19.32
$1N4160: length 4.7
  Top Layer w0.127: 13.95,17.84 14.97,17.84 v1(15.02,17.79) ; 14.93,19.82 14.26,19.82 14.26,19.82 v1(14.01,19.56)
  Bottom Layer w0.152: v1(14.01,19.56) 14.64,19.56 15.02,19.18 v1(15.02,17.79)
$1N4317: length 6.1
  Top Layer w0.127: 7.98,19.73 7.86,19.61 7.86,18.03 8.11,17.79 11.41,17.79 11.92,18.29
$1N4322: length 2.6
  Top Layer w0.127: 9.36,18.29 9.97,18.29 Q2.1
$1N4474: length 2.4
  Top Layer w0.127: U3.10 17.18,14.42 17.38,14.61 17.94,14.61 18.2,14.86 18.2,15.35 C2.2
$1N4542: length 2.9
  Top Layer w0.127: U3.20 16.68,9.42 16.29,9.02 15.78,9.02 15.28,9.53 14.55,9.53 14.51,9.49
$1N4984: length 3.9
  Top Layer w0.254: 12.17,1.61 12.52,1.61 arc(12.71,1.57) 12.88,1.46 13.57,0.76 arc(13.87,0.56) 14.23,0.49 14.67,0.49 arc(14.87,0.53) 15.04,0.64 arc(15.14,0.8) 15.17,0.98 15.17,1.24
$1N7801: length 21.5
  Top Layer w0.254: 24.11,3.85 24.11,4.5 v1(23.66,4.96) ; v1(22.64,19.82) 23.4,20.58 L3.2 ; v1(24.17,14.23) v1(24.17,11.56)
  Bottom Layer w0.254: C11.2 22.81,4.11 v1(23.66,4.96) 24.17,5.47 v1(24.17,11.56) ; v1(22.64,19.82) 22.64,17.91 23.53,17.02 23.53,14.86 v1(24.17,14.23)
$1N7802: length 2.4
  Top Layer w0.254: v1(23.15,3.05) 23.15,1.57 23.16,1.55
  Bottom Layer w0.254: v1(23.15,3.05) 23.11,3.02 C11.1
$1N7803: length 2.7
  Bottom Layer w0.254: R12.2 R4.2 R11.1
$1N7813: length 9.6
  Top Layer w0.254: 24.11,1.55 24.11,2.67 v1(24.55,3.11)
  Bottom Layer w0.254: v1(24.55,3.11) 24.55,8.45 25.44,9.34 R13.1
$1N7855: length 9.8
  Top Layer w0.127: v1(25.06,2.92) 25.05,2.91
  Top Layer w0.254: 25.06,1.55 v1(25.06,2.92)
  Bottom Layer w0.254: R12.1 26.71,9.4 25.06,7.76 v1(25.06,2.92)

# Board test
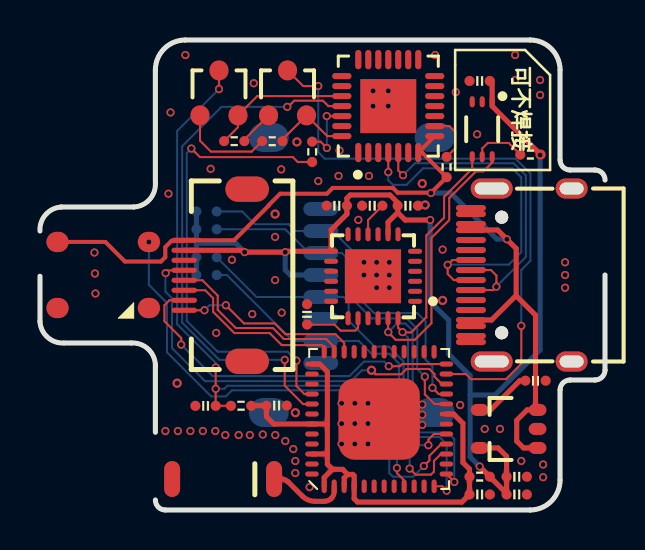
[diagram p3: board, top side]
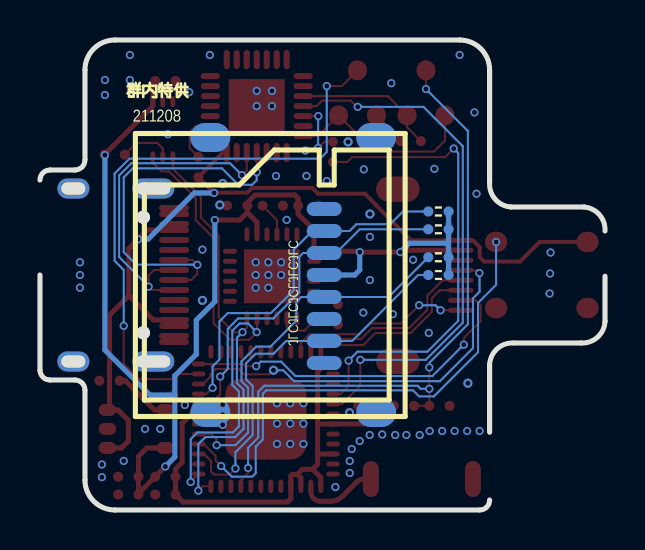
[diagram p4: board, bottom side, seen from below]

Outline 28.28 x 23.5 mm; copper layers: Top Layer, Bottom Layer. Coordinates in mm from the lower left corner of the outline.
Outline path: 1.08,15.15 arc(0.29,14.77) 0,13.95 arc(0.29,14.77) 1.08,15.15 ; 1.08,15.15 4.7,15.15 ; 0,9.42 0,11.69 0,9.42 ; 0,9.42 arc(0.38,8.64) 1.2,8.35 ; 0,9.42 arc(0.38,8.64) 1.2,8.35 ; 1.05,15.15 4.7,15.15 ; 4.7,15.15 arc(5.49,15.53) 5.78,16.35 ; 4.7,15.15 arc(5.49,15.53) 5.78,16.35 ; 1.2,8.35 4.58,8.35 ; 1.2,8.35 4.58,8.35 ; 4.58,8.35 arc(5.4,8.06) 5.78,7.28 ; 4.58,8.35 arc(5.4,8.06) 5.78,7.28 ; 5.78,7.28 5.78,3.89 5.78,7.25 ; 5.78,22 5.78,16.35 ; 5.78,22 arc(6.21,23.06) 7.28,23.5 ; 5.78,22 arc(6.21,23.06) 7.28,23.5 ; 5.78,22 5.78,16.38 ; 7.28,23.5 24.53,23.5 ; 7.28,23.5 24.53,23.5 ; 6.28,0 arc(5.92,0.15) 5.78,0.5 arc(5.92,0.15) 6.28,0 ; 6.28,0 24.53,0 ; 6.28,0 24.53,0 ; 24.53,0 arc(25.59,0.44) 26.03,1.5 ; 24.53,0 arc(25.59,0.44) 26.03,1.5 ; 24.53,23.5 arc(25.59,23.06) 26.03,22 ; 24.53,23.5 arc(25.59,23.06) 26.03,22 ; 26.03,22 26.03,17.5 ; 26.03,22 26.03,17.5 ; 26.03,17.5 arc(26.17,17.15) 26.53,17 ; 26.03,17.5 arc(26.17,17.15) 26.53,17 ; 26.03,6 26.03,1.5 ; 26.03,6 arc(26.17,6.35) 26.53,6.5 ; 26.03,6 arc(26.17,6.35) 26.53,6.5 ; 26.03,6 26.03,1.5 ; 26.53,6.5 27.78,6.5 ; 26.53,6.5 27.78,6.5 ; 26.53,17 27.78,17 ; 26.53,17 27.78,17 ; 27.78,17 arc(28.13,16.85) 28.28,16.5 arc(28.13,16.85) 27.78,17 ; 27.78,6.5 arc(28.13,6.65) 28.28,7 ; 27.78,6.5 arc(28.13,6.65) 28.28,7 ; 28.28,7 28.28,11.75 28.28,7
Stack: Top Layer 0.04mm / Dielectric 2 1.1mm PP-006 er 4.2 / Bottom Layer 0.04mm

## Design rules (mm)
spacing Clearance (default): track to track 0.127, other pairs 0.127 to 0.127
track width Width (default): min 0.102, default 0.102, max 254
differential pair DiffPairsRouting (default): width min 0.102, default 0.102, max 0.102; gap min 0.229, default 0.229
via RoutingVias (default): diameter min 0.305, default 0.406, max 1.27; hole min 0.152, default 0.203, max 0.711

## Placement (name value [footprint] x y rotation side)
A1  AN2051  [ANT-Rainsun-AN5120]  9.18 1.55 180 top
C1  0.1uF  [CAP_0402]  23.86 0.78 180 top
C2  10uF  [CAP_0402]  23.86 1.67 180 top
C3  10nF  [CAP_0402]  24.8 6.47 180 top
C4  10uF  [CAP_0402]  22 0.78 180 top
C5  0.1uF  [CAP_0402]  11.84 5.22 180 top
C6  10nF  [CAP_0402]  18.41 15.22 0 top
C7  10uF  [CAP_0402]  8.28 5.21 180 top
C8  0.1uF  [CAP_0402]  16.63 15.22 180 top
C9  2.2nF  [CAP_0402]  13.37 9.78 270 top
C10  0.1uF  [CAP_0402]  14.85 15.22 0 top
C11  0.1uF  [CAP_0402]  22 21.45 180 top
CON1  -  [FFC_0.5_8]  9.48 11.74 90 top
D1  WS2812B  [LED_5050_WS2812B]  3.16 11.75 0 top
J1  TF-Socket  [TF_F]  14.05 11.75 90 bottom
R1  10K  [RES_0402]  20.35 17.15 90 top
R2  0R  [RES_0402]  22 1.67 180 top
R3  200R  [RES_0402]  13.62 17.91 90 top
R4  12K  [RES_0402]  11.63 18.44 180 top
R5  12K  [RES_0402]  9.72 18.44 0 top
R6  10K  [RES_0402]  10.06 5.21 180 top
R7  10K  [RES_0402]  8.34 11.75 0 bottom
R8  10K  [RES_0402]  8.34 14.04 0 bottom
R9  10K  [RES_0402]  8.34 12.64 0 bottom
R10  10K  [RES_0402]  8.34 14.92 0 bottom
R11_1_1  10K  [RES_0402]  24.54 17.77 0 top
U1  CP2102  [QFN-28]  17.43 20.2 90 top
U2  ME6211C33 3V3  [SOT23-5]  23.4 4.05 180 top
U3  MPU6050  [QFN-24]  16.67 11.69 180 top
U4  ESP32_SIP  [QFN-48_7X7]  16.97 4.55 90 top
U5  BH1750FVI-TR  [BH1750FVI]  22.13 19.04 270 top
USB1  Type-C 16P  [Type-C-TOP]  24.08 11.75 0 top
VT1  S8050  [SMT_TRIODE_NPN]  8.96 20.86 0 top
VT2  S8050  [SMT_TRIODE_NPN]  12.39 20.86 0 top

## Footprints (pads in the part's own frame, mm; a bottom-side part is the same pattern mirrored in y, then rotated)
ANT-Rainsun-AN5120
  rrect 0.8x1.8 smd: 1(-2.54,0) 2(2.563,0)
BH1750FVI
  rrect 0.55x0.25 smd: 1(-1.375,0.5) 2(-1.375,0) 3(-1.375,-0.5) 4(1.375,-0.5) 5(1.375,0) 6(1.375,0.5)
CAP_0402
  rrect 0.508x0.508 smd: 1(-0.508,0) 2(0.508,0)
FFC_0.5_8
  rrect 1.27x2.184 smd: 0(-4.306,-0.889) 0(4.306,-0.889)
  rrect 0.254x1.27 smd: 1(-1.75,2.26) 2(-1.25,2.26) 3(-0.75,2.26) 4(-0.25,2.26) 5(0.25,2.26) 6(0.75,2.26) 7(1.25,2.26) 8(1.75,2.26)
LED_5050_WS2812B
  rrect 1.117x1.016 smd: 1(-2.286,1.651) 2(-2.286,-1.651) 3(2.286,-1.651) 4(2.286,1.651)
QFN-24
  oval 0.7x0.25 smd: 1(-2.1,1.25) 2(-2.1,0.75) 3(-2.1,0.25) 4(-2.1,-0.25) 5(-2.1,-0.75) 6(-2.1,-1.25) 13(2.1,-1.25) 14(2.1,-0.75) 15(2.1,-0.25) 16(2.1,0.25) 17(2.1,0.75) 18(2.1,1.25)
  oval 0.25x0.7 smd: 7(-1.25,-2.1) 8(-0.75,-2.1) 9(-0.25,-2.1) 10(0.25,-2.1) 11(0.75,-2.1) 12(1.25,-2.1) 19(1.25,2.1) 20(0.75,2.1) 21(0.25,2.1) 22(-0.25,2.1) 23(-0.75,2.1) 24(-1.25,2.1)
  rect 2.8x2.7 smd: 25(0,0)
QFN-28
  rrect 0.965x0.305 smd: 1(-2.324,1.5) 2(-2.324,1) 3(-2.324,0.5) 4(-2.324,0) 5(-2.324,-0.5) 6(-2.324,-1) 7(-2.324,-1.5) 15(2.324,-1.5) 16(2.324,-1) 17(2.324,-0.5) 18(2.324,0) 19(2.324,0.5) 20(2.324,1) 21(2.324,1.5)
  rrect 0.305x0.965 smd: 8(-1.5,-2.324) 9(-1,-2.324) 10(-0.5,-2.324) 11(0,-2.324) 12(0.5,-2.324) 13(1,-2.324) 14(1.5,-2.324) 22(1.5,2.324) 23(1,2.324) 24(0.5,2.324) 25(0,2.324) 26(-0.5,2.324) 27(-1,2.324) 28(-1.5,2.324)
  rect 2.7x2.8 smd: 29(0,0)
QFN-48_7X7
  rrect 4.064x4.064 smd: 0(0,0)
  rrect 0.675x0.25 smd: 1(-3.362,2.75) 2(-3.362,2.25) 3(-3.362,1.75) 4(-3.362,1.25) 5(-3.362,0.75) 6(-3.362,0.25) 7(-3.362,-0.25) 8(-3.362,-0.75) 9(-3.362,-1.25) 10(-3.362,-1.75) 11(-3.362,-2.25) 12(-3.362,-2.75) 25(3.362,-2.75) 26(3.362,-2.25) 27(3.362,-1.75) 28(3.362,-1.25) 29(3.362,-0.75) 30(3.362,-0.25) 31(3.362,0.25) 32(3.362,0.75) 33(3.362,1.25) 34(3.362,1.75) 35(3.362,2.25) 36(3.362,2.75)
  rrect 0.25x0.675 smd: 13(-2.75,-3.362) 14(-2.25,-3.362) 15(-1.75,-3.362) 16(-1.25,-3.362) 17(-0.75,-3.362) 18(-0.25,-3.362) 19(0.25,-3.362) 20(0.75,-3.362) 21(1.25,-3.362) 22(1.75,-3.362) 23(2.25,-3.362) 24(2.75,-3.362) 37(2.75,3.362) 38(2.25,3.362) 39(1.75,3.362) 40(1.25,3.362) 41(0.75,3.362) 42(0.25,3.362) 43(-0.25,3.362) 44(-0.75,3.362) 45(-1.25,3.362) 46(-1.75,3.362) 47(-2.25,3.362) 48(-2.75,3.362)
RES_0402
  rrect 0.508x0.508 smd: 1(-0.508,0) 2(0.508,0)
SMT_TRIODE_NPN
  rrect 0.95x1 smd: 1(-0.95,-1.125) 2(0.95,-1.125) 3(0,1.125)
SOT23-5
  rrect 0.889x0.6 smd: 1(-1.5,0.95) 2(-1.5,0) 3(-1.5,-0.95) 4(1.395,-0.95) 5(1.395,0.95)
TF_F
  rrect 1.45x2 smd: 0(-6.875,-2.6) 0(-6.875,5.7) 0(6.875,-2.6) 0(6.875,5.7)
  rrect 0.7x1.75 smd: 1(3.3,0) 2(2.2,0) 3(1.1,0) 4(0,0) 5(-1.1,0) 6(-2.2,0) 7(-3.3,0) 8(-4.4,0)
Type-C-TOP
  round 0.65 hole 0.65: 0(-0.98,2.89) 0(-0.98,-2.89)
  oval 1.6x1 hole 1.2x0.6: 1(2.52,4.325) 2(2.52,-4.325)
  oval 2.1x1 hole 1.7x0.6: 3(-1.48,-4.325) 4(-1.48,4.325)
  rrect 1.5x0.3 smd: A1(-2.52,-3.35) A4(-2.52,-2.55) A5(-2.52,-1.25) A6(-2.52,-0.25) A7(-2.52,0.25) A8(-2.52,1.25) A9(-2.52,2.55) A12(-2.52,3.35) B1(-2.52,3.05) B4(-2.52,2.25) B5(-2.52,1.75) B6(-2.52,0.75) B7(-2.52,-0.75) B8(-2.52,-1.75) B9(-2.52,-2.25) B12(-2.52,-3.05)

## Nets
3V3: C1.2 C2.2 C6.1 C10.2 C11.1 CON1.7 J1.4 R2.1 R7.1 R8.1 R9.1 R10.1 R11_1_1.2 U2.5 U3.8 U3.13 U5.1
3V3A: C4.2 C5.2 R2.2 R6.1 U4.1 U4.3 U4.4 U4.19 U4.37 U4.43 U4.46
GND: C1.1 C2.1 C3.1 C4.1 C5.1 C6.2 C7.2 C8.2 C9.1 C10.1 C11.2 CON1.0 CON1.6 D1.3 J1.0 J1.6 U1.3 U1.29 U2.2 U3.1 U3.9 U3.11 U3.18 U4.0 U5.2 U5.3 USB1.1 USB1.2 USB1.3 USB1.4 USB1.A1 USB1.A12 USB1.B1 USB1.B12
VDD_5V: CON1.8 D1.1 R1.1 U1.7 U1.8 U2.1 U2.3 USB1.A4 USB1.A9 USB1.B4 USB1.B9
BH_SCL: U3.23 U4.13 U5.6
BH_SDA: U3.24 U4.12 U5.4
CP_RX: U1.25 U4.41
CP_TX: R3.1 U4.40
DC: CON1.5 U4.22
DTR: R4.1 U1.28 VT2.2
EN: C7.1 R6.2 U4.9 VT1.3
FLASH_CLK: U4.31
FLASH_CS: U4.25
FLASH_SD0: U4.27
FLASH_SD1: U4.33
FLASH_SD2: U4.30
FLASH_SD3: U4.32
GPIO0: U4.23 VT2.3
GPIO4: CON1.2 U4.24
GPIO5: CON1.1 U4.34
GPIO9: U4.28
GPIO10: U4.29
GPIO12: U4.18
GPIO13: J1.3 R8.2 U4.20
GPIO14: J1.5 R9.2 U4.17
GPIO15: J1.2 R10.2 U4.21
GPIO18: CON1.4 U4.35
GPIO19: U4.38
GPIO21: U4.42
GPIO22: U4.39
GPIO23: CON1.3 U4.36
GPIO25: U4.14
GPIO26: J1.7 R7.2 U4.15
GPIO27: D1.4 U4.16
GPIO34: U4.10
GPIO35: U4.11
GPIO37: U4.6
GPIO38: U4.7
METR11_1: R11_1_1.1 U5.5
NETA1_1: A1.1 U4.2
NETC3_2: C3.2 U2.4
NETC8_1: C8.1 U3.10
NETC9_2: C9.2 U3.20
NETR1_2: R1.2 U1.9
NETR3_2: R3.2 U1.26
NETR4_2: R4.2 VT1.1
NETR5_2: R5.2 VT2.1
RTS: R5.1 U1.24 VT1.2
SENSOR_VN: U4.8
SENSOR_VP: U4.5
USB-PWR-DM: U1.5 USB1.A7 USB1.B7
USB-PWR-DP: U1.4 USB1.A6 USB1.B6

Pads without a net: A1 2; D1 2; J1 1 8; U1 1 2 6 10 11 12 13 14 15 16 17 18 19 20 21 22 23 27; U3 2 3 4 5 6 7 12 14 15 16 17 19 21 22 25; U4 26 44 45 47 48; USB1 0 A5 A8 B5 B8

## Via types
v1: diameter 0.406, hole 0.254, Top Layer to Bottom Layer, 114 vias
v2: diameter 0.457, hole 0.254, Top Layer to Bottom Layer, 8 vias

## Routing (per net, layer and track width the routed paths; a pad name or vN(x,y) marks a point on that pad's centre or on a via; arc(x,y) is an arc through that point)
3V3: length 62.6
  Top Layer w0.254: R11_1_1.2 22.63,20.19 U5.1 22.63,21.33 ; 17.9,14.87 17.42,14.39 U3.8 ; 17.9,14.87 C6.1 17.9,15.36 17.51,15.75 15.53,15.75 15.36,15.58 C10.2 15.36,14.8 14.57,14.01 U3.13 12.27,12.94 ; 17.9,14.87 18.27,14.5 v1(19.53,14.5) ; v1(22,2.17) R2.1 23.35,0.83 C2.2 23.35,2.68 22.93,3.1 U2.5 ; v1(10.24,12.89) 10.15,12.99 CON1.7 ; v1(12.27,12.89) 10.34,12.89 10.29,12.94
  Bottom Layer w0.254: 21.53,5.75 21.53,2.65 v1(22,2.17) ; 21.53,5.75 21.53,6.71 20.45,7.79 20.45,9.49 19.53,10.42 v1(19.53,14.5) ; 21.53,5.75 22.78,5.75 25.03,8 v1(25.03,17.75) ; R10.1 R8.1 7.83,13.34 ; v1(12.27,12.89) 12.27,12 12.53,11.75 J1.4 ; 7.83,13.34 9.8,13.34 v1(10.24,12.89) ; 7.83,13.34 R9.1 R7.1
3V3A: length 26
  Top Layer w0.254: 15.4,1.78 15.14,2.03 14.64,2.03 ; 15.4,1.78 15.65,1.78 15.72,1.71 U4.4 15.72,0.57 15.88,0.41 ; 15.4,1.78 15.22,1.61 U4.3 ; R6.1 10.58,5.22 C5.2 11.33,4.66 11.7,4.3 U4.43 14.38,4.3 ; 14.38,2.8 14.38,4.3 ; 14.38,2.8 U4.46 ; 14.38,2.8 14.38,2.29 14.64,2.03 ; 14.38,4.3 14.38,6.91 13.99,7.3 U4.37 ; U4.19 20.7,4.8 21.16,4.33 21.16,2.38 21.49,2.05 R2.2 C4.2 21.11,0.4 15.88,0.4 ; 14.64,2.03 14.22,1.62 U4.1
GND: length 0.1
  Top Layer w0.203: v1(9.61,12.51) 9.53,12.51 9.5,12.49
  vias: v1(2.75,11.83) v1(6.28,3.95) v1(6.43,15.81) v1(6.53,19.88) v1(6.9,3.95) v1(7.28,22.75) v1(7.53,3.95) v1(8.15,3.95) v1(8.54,17.06) v1(8.82,8.85) v1(8.78,3.95) v1(9.28,3.75) v1(9.94,3.75) v1(10.5,3.75) v1(10.62,9.79) v1(10.7,21.34) v1(11.15,3.78) v1(11.77,13.66) v1(11.77,11.5) v1(11.78,3.75) v1(12.07,17.03) v1(12.09,9.87) v1(12.28,3.45) v1(12.68,3.05) v1(12.78,2.45) v1(12.78,1.85) v1(13.49,1.15) v1(13.92,16.45) v1(14.99,17.97) v1(14.94,16.7) v1(15.09,5.34) v1(15.09,4.32) v1(15.09,3.3) v1(15.75,5.34) v1(15.75,4.32) v1(15.75,3.3) v1(15.93,14.51) v1(16.21,12.39) v1(16.21,11.75) v1(16.41,5.34) v1(16.41,4.32) v1(16.41,3.3) v1(16.46,16.7) v1(16.67,20.96) v1(16.67,20.2) v1(16.84,12.39) v1(16.84,11.75) v1(16.84,11.11) v1(17.43,20.96) v1(17.43,20.2) v1(17.48,12.39) v1(17.48,11.75) v1(17.48,11.11) v1(19.13,5.27) v1(19.13,4.77) v1(19.13,4.26) v1(19.78,22.75) v1(20.15,13.02) v1(20.81,20.89) v1(21.03,5.25) v1(21.87,18.79) v1(22.25,4.05) v1(23.02,4.05) v1(23.78,22.75) v1(23.78,21.5) v1(24.08,2.45) v1(25.03,21.5) v1(25.03,20.75) v1(25.18,2.28) v1(25.18,1.64) v2(6.86,6.34) v2(11.77,14.8) v2(12.78,4.87) v2(12.86,18.41) v2(19.13,16.32) v2(19.28,15.25) v2(20.15,10.48)
VDD_5V: length 47.1
  Top Layer w0.2: 7.22,13.5 8.01,13.49 9.71,13.49 11.46,15.23 11.46,15.25 12.02,15.81 14.36,15.81 14.65,16.1 17.66,16.1 17.9,15.87 19.42,15.87 ; U1.8 U1.7 19.12,17.87 R1.1 v1(19.56,15.85) ; D1.1 3.27,13.4 4.25,12.42 6.05,12.42 6.27,12.65 6.27,13.15 6.59,13.46 7.19,13.46 CON1.8
  Top Layer w0.254: 23.83,10.71 24.8,9.74 24.8,5 24.37,5 23.86,4.49 23.86,3.44 24.2,3.1 U2.1 ; USB1.B9 22.6,9.5 23.83,10.73 23.83,13.07 v1(23.37,13.54) 22.9,14 USB1.B4
  Bottom Layer w0.254: 23.37,13.55 22.86,13.55 20.55,15.85 v1(19.56,15.85)
(no net):
  vias: v1(2.72,12.88) v1(2.78,10.83) v1(26.28,12.39) v1(26.28,11.75) v1(26.28,11.11)
BH_SCL: length 25
  Top Layer w0.102: U5.6 22.63,17.4 22.64,17.39 22.19,16.93 21.82,16.93 20.48,15.59 20.48,14.49 19.59,13.6 19.59,9.34 18.76,8.51 17.8,8.51 17.42,8.89 17.42,8.9 ; 17.42,8.9 U3.23 ; 17.42,8.9 v1(17.43,8.89) ; U4.13 v1(20.73,1.4)
  Bottom Layer w0.102: v1(17.43,8.89) 17.86,9.32 18.29,9.32 18.65,8.96 18.65,6.25 18.32,5.92 18.32,4.18 18.62,3.88 20.4,3.88 20.73,3.55 20.73,1.4 v1(20.73,1.4)
BH_SDA: length 22
  Top Layer w0.102: v1(18.14,8.89) 17.92,9.12 U3.24 ; U4.12 20.13,1.19 v1(20.35,0.97) ; 18.14,8.88 18.57,8.88 19.33,9.64 19.33,13.73 20.22,14.62 20.22,15.66 21.63,17.07 U5.4
  Bottom Layer w0.102: v1(18.14,8.89) 18.42,8.62 18.42,7.53 18.42,7.53 18.42,6.35 18.09,6.02 18.09,4.05 18.5,3.65 19.99,3.65 20.35,3.29 v1(20.35,0.97)
CP_RX: length 26.9
  Top Layer w0.102: U4.41 13.16,5.3 12.25,6.21 v1(12.25,7.51) ; v1(12.37,20.16) 12.37,20.12 12.72,20.47 14.16,20.47 14.43,20.2 U1.25
  Bottom Layer w0.102: v1(12.25,7.51) 8.97,7.51 7.12,9.36 7.12,18.19 8.54,19.61 9.09,20.16 v1(12.37,20.16)
CP_TX: length 23.6
  Top Layer w0.102: v1(7.57,18.07) 8.01,17.64 12.65,17.64 12.9,17.4 R3.1 ; v1(12.83,7.47) 12.83,6.2 13.23,5.8 U4.40
  Bottom Layer w0.102: v1(7.57,18.07) 7.35,17.85 7.35,9.46 8.89,7.91 12.39,7.91 v1(12.83,7.47)
DC: length 20.1
  Top Layer w0.102: v1(6.29,11.85) 6.29,11.91 6.36,11.98 7.21,11.98 CON1.5 ; U4.22 20.11,6.3 19.74,6.67 19.74,6.8 19.49,7.05 18.34,7.05 18.07,6.78 16.79,6.78 v2(16.59,6.99)
  Bottom Layer w0.102: v2(16.59,6.99) 16.11,6.99 15.56,6.44 8.26,6.44 6.61,8.09 6.61,10.58 6.28,10.91 6.28,11.84 v1(6.29,11.85)
DTR: length 4
  Top Layer w0.102: U1.28 14.37,18.7 VT2.2 12.13,18.53 R4.1
EN: length 33
  Top Layer w0.102: v1(8.79,7.13) C7.1 R6.2 ; U4.9 18.22,1.48 17.86,1.84 v1(17.86,2.1) ; v1(8.96,21.05) VT1.3
  Bottom Layer w0.102: v1(8.96,21.05) 6.86,18.95 6.86,9.29 8.79,7.36 v1(8.79,7.13) ; v1(17.86,2.1) 17.86,3.11 17.35,3.62 17.35,5.91 17.05,6.21 9.38,6.21 9.22,6.06 v1(8.79,6.06)
GPIO0: length 30.1
  Top Layer w0.102: VT2.3 13.17,21.2 v1(13.92,21.2) ; v1(24.08,9.21) 24.08,7.31 23.32,6.54 21.57,6.54 21.31,6.8 U4.23
  Bottom Layer w0.102: v1(13.92,21.2) 13.92,17.9 14.25,17.57 23.8,17.57 24.54,16.82 24.54,12.46 24.08,12 v1(24.08,9.21)
GPIO4: length 17.8
  Top Layer w0.102: v1(17.45,7.19) 18.01,7.19 18.12,7.3 U4.24 ; CON1.2 6.48,10.49 6.23,10.24 6.23,9.44 7.07,8.6 v1(7.07,8.27)
  Bottom Layer w0.102: v1(7.07,8.27) 8.64,6.7 15.49,6.7 16.21,7.42 17.23,7.42 v1(17.45,7.19)
GPIO5: length 9.3
  Top Layer w0.102: U4.34 15.22,8.36 14.79,8.79 12.29,8.79 11.75,9.33 10.21,9.33 v1(9.3,10.24) ; CON1.1 v1(8.23,9.99)
  Bottom Layer w0.102: v1(9.3,10.24) 8.48,10.24 v1(8.23,9.99)
GPIO13: length 17.9
  Top Layer w0.102: U4.20 19.74,5.3 19.26,5.78 v1(19.26,6.67)
  Bottom Layer w0.102: v1(19.26,6.67) 18.88,7.05 18.88,9.06 18.36,9.58 16.59,9.58 16.59,9.59 15.3,10.89 15.3,12.66 15.11,12.85 J1.3 13.46,12.85 12.27,14.04 8.84,14.04
GPIO14: length 18.9
  Top Layer w0.102: v1(19.44,3.24) 19.44,3.52 19.71,3.8 U4.17
  Bottom Layer w0.102: v1(19.44,3.24) 18.5,3.24 17.86,3.88 17.86,6.11 18.19,6.44 18.19,7.43 17.45,8.17 16.74,8.17 15.45,9.46 15.45,10.4 15.19,10.65 J1.5 10.83,10.65 8.84,12.64
GPIO15: length 18.2
  Top Layer w0.102: U4.21 19.95,5.8 v1(19.64,6.11)
  Bottom Layer w0.102: v1(19.64,6.11) 19.64,7.18 19.3,7.52 19.3,9.43 18.88,9.84 16.72,9.84 15.58,10.99 15.58,13.02 14.65,13.95 J1.2 12.78,13.95 12.44,14.29 10.75,14.29 10.11,14.92 8.84,14.92
GPIO18: length 9.6
  Top Layer w0.102: CON1.4 8.13,11.49 8.9,10.72 8.9,10 9.8,9.1 11.65,9.1 12.2,8.55 14.33,8.55 14.72,8.16 U4.35
GPIO23: length 8.8
  Top Layer w0.102: U4.36 14.22,8.12 14.1,8.25 12.09,8.25 11.49,8.85 9.73,8.85 8.67,9.91 8.67,10.59 8.27,10.99 CON1.3
GPIO26: length 19.4
  Top Layer w0.102: U4.15 20.06,2.8 19.72,2.45 19.72,1.92 19.56,1.77 18.8,1.77 v1(18.5,2.07)
  Bottom Layer w0.102: v1(18.5,2.07) 18.5,2.89 17.63,3.75 17.63,6.2 17.96,6.53 17.96,7.33 17.48,7.81 16.59,7.81 15.95,8.45 J1.7 12.65,8.45 9.35,11.75 8.84,11.75
GPIO27: length 25.6
  Top Layer w0.102: U4.16 20.08,3.3 19.49,2.71 19.49,2.48 v1(19.21,2.2)
  Bottom Layer w0.102: v1(19.21,2.2) 18.67,1.67 17.66,1.67 17.48,1.84 17.48,3.17 17.12,3.53 17.12,5.81 16.95,5.98 9.61,5.98 9.3,5.68 8.56,5.68 6.36,7.89 6.36,10.35 5.45,11.26 v1(5.45,13.4)
METR11_1: length 2.7
  Top Layer w0.102: R11_1_1.1 23.45,18.35 22.41,18.35 22.13,18.07 U5.5
NETA1_1: length 3.9
  Top Layer w0.254: U4.2 14.72,0.92 arc(14.69,0.74) 14.58,0.59 arc(14.42,0.47) 14.22,0.43 13.78,0.43 arc(13.42,0.5) 13.12,0.71 12.43,1.4 arc(12.26,1.51) 12.06,1.55 A1.1
NETC3_2: length 2.9
  Top Layer w0.254: C3.2 24.01,6.47 22.55,5 U2.4
NETC8_1: length 1.7
  Top Layer w0.102: U3.10 16.42,14.5 C8.1
NETC9_2: length 3.2
  Top Layer w0.102: U3.20 15.92,9.11 15.78,8.97 15.04,8.97 14.74,9.27 C9.2
NETR1_2: length 2.6
  Top Layer w0.102: U1.9 20.49,19.2 20.78,18.9 20.78,18.09 R1.2
NETR3_2: length 3.2
  Top Layer w0.102: v1(14.36,18.1) 14.04,18.42 R3.2 ; v1(14.35,19.7) U1.26
  Bottom Layer w0.102: v1(14.36,18.1) 14.36,19.69 v1(14.35,19.7)
NETR4_2: length 4.8
  Top Layer w0.102: R4.2 10.6,17.92 8.55,17.92 8.01,18.47 VT1.1
NETR5_2: length 1.8
  Top Layer w0.102: VT2.1 10.23,18.52 R5.2
RTS: length 7.2
  Top Layer w0.102: R5.1 9.91,19.14 VT1.2 10.87,20.7 U1.24
USB-PWR-DM: length 17.3
  Top Layer w0.102: USB1.B7 22.67,11 v1(22.84,11.17) 22.84,11.72 22.56,12 USB1.A7 ; U1.5 17.93,16.98 v1(18.17,16.74)
  Bottom Layer w0.102: 22.84,11.18 23.4,11.74 24.31,12.65 24.31,16.73 23.7,17.34 18.76,17.34 v1(18.17,16.74)
USB-PWR-DP: length 19.4
  Top Layer w0.102: USB1.A6 20.7,11.5 20.4,11.8 v1(20.4,12.26) 20.64,12.5 USB1.B6 ; v1(17.43,16.89) U1.4
  Bottom Layer w0.102: 20.4,12.27 23.46,12.27 24.08,12.89 24.08,16.63 23.63,17.08 19.17,17.08 18.34,16.26 17.66,16.26 17.43,16.49 v1(17.43,16.89)

Small or netless copper shapes (teardrops, artwork), in the pictures only: 130 on Top Layer, 57 on Bottom Layer

## Text on the board
Bottom Silkscreen Layer: JLCJLCJCLJLCJLC | 211208 | 群内特供
Top Silkscreen Layer: 可不焊接
